# Altium schematic sheet CH32F203C8U6-R0.SchDoc
size 279 x 172 mm; SheetNumber: 0; SheetTotal: 0
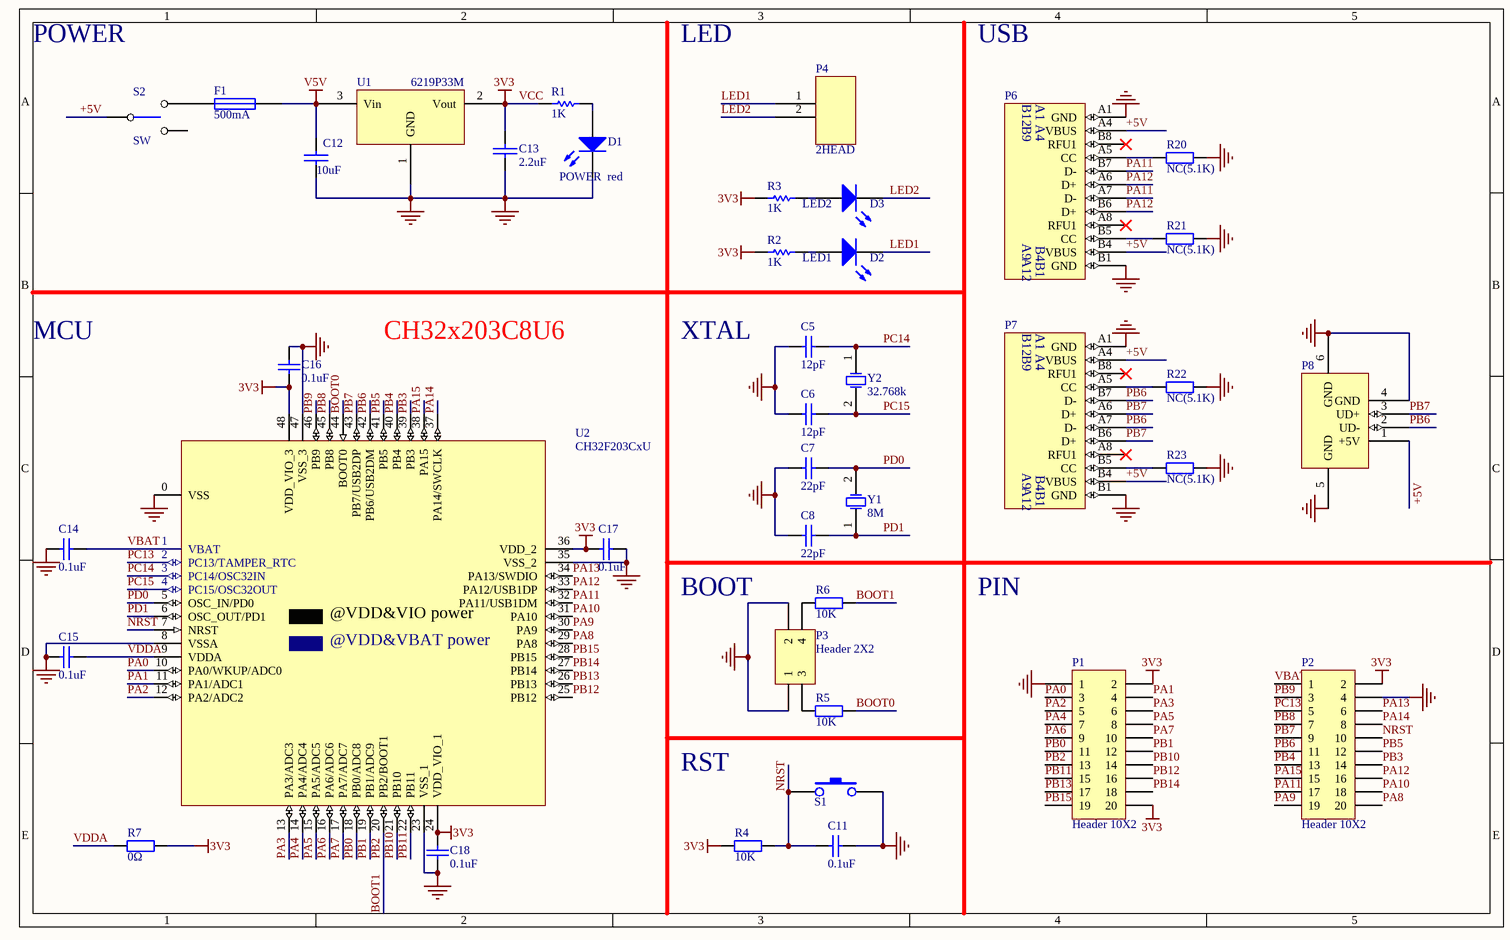
[diagram p0: CH32F203C8U6-R0.SchDoc]

## Parts
C5  12pF  [0603]
C6  12pF  [0603]
C7  22pF  [0603]
C8  22pF  [0603]
C11  0.1uF  [0603]
C12  10uF  [3216]
C13  2.2uF  [0603]
C14  0.1uF  [0603]
C15  0.1uF  [0603]
C16  0.1uF  [0603]
C17  0.1uF  [0603]
C18  0.1uF  [0603]
D1  POWER  red  [0603L]
D2  LED1  [0603L]
D3  LED2  [0603L]
F1  500mA  [0603]
P1  Header 10X2  [IDC20]
P2  Header 10X2  [IDC20]
P3  Header 2X2  [HDR2X2]
P4  2HEAD  [SIP2 - 40mil]
P6  TYPE-C  [TYPE-C-Receptacle-2.0]  (value not drawn)
P7  TYPE-C  [TYPE-C-Receptacle-2.0]  (value not drawn)
P8  USB_A  [USBA-L]  (value not drawn)
R1  1K  [0603]
R2  1K  [0603]
R3  1K  [0603]
R4  10K  [0603]
R5  10K  [0603]
R6  10K  [0603]
R7  0Ω  [0603]
R20  NC(5.1K)  [0603]
R21  NC(5.1K)  [0603]
R22  NC(5.1K)  [0603]
R23  NC(5.1K)  [0603]
S1  KEY  [贴片按键]  (value not drawn)
S2  SW  [KEY2]
U1  6219P33M  [SOT-23]
U2  CH32F203CxU  [QFN48_7X7]
Y1  8M  [XT62/28]
Y2  32.768k  [FC-135]

## Nets
GND: C5.2 C6.2 C7.1 C8.1 C11.1 C12.2 C13.2 C14.2 C15.2 C16.1 C17.1 C18.1 D1.2(K) P1.1 P2.4 P3.1 P3.2 P6.A1(GND) P6.B1(GND) P7.A1(GND) P7.B1(GND) P8.4(GND) P8.5(GND) P8.6(GND) R20.2 R21.2 R22.2 R23.2 S1.3 U1.1(GND) U2.0(VSS) U2.8(VSSA) U2.23(VSS_1) U2.35(VSS_2) U2.47(VSS_3)
V5V: C12.1 F1.2 U1.3(Vin)
VCC: C13.1 C16.2 C17.2 C18.2 P1.2 P1.20 P2.2 R1.2 R2.1 R3.1 R4.2 R7.1 U1.2(Vout) U2.24(VDD_VIO_1) U2.36(VDD_2) U2.48(VDD_VIO_3)  [also labelled 3V3]
+5V: P6.A4(VBUS) P6.B4(VBUS) P7.A4(VBUS) P7.B4(VBUS) P8.1(+5V) S2.1
BOOT0: R5.1 U2.44(BOOT0)
BOOT1: P1.13 R6.1 U2.20(PB2/BOOT1)  [also labelled PB2]
LED1: D2.2(K) P4.1
LED2: D3.2(K) P4.2
NRST: C11.2 P2.10 R4.1 S1.1 U2.7(NRST)
PA0: P1.3 U2.10(PA0/WKUP/ADC0)
PA1: P1.4 U2.11(PA1/ADC1)
PA2: P1.5 U2.12(PA2/ADC2)
PA3: P1.6 U2.13(PA3/ADC3)
PA4: P1.7 U2.14(PA4/ADC4)
PA5: P1.8 U2.15(PA5/ADC5)
PA6: P1.9 U2.16(PA6/ADC6)
PA7: P1.10 U2.17(PA7/ADC7)
PA8: P2.20 U2.29(PA8)
PA9: P2.19 U2.30(PA9)
PA10: P2.18 U2.31(PA10)
PA11: P2.17 P6.A7(D-) P6.B7(D-) U2.32(PA11/USB1DM)
PA12: P2.16 P6.A6(D+) P6.B6(D+) U2.33(PA12/USB1DP)
PA13: P2.6 U2.34(PA13/SWDIO)
PA14: P2.8 U2.37(PA14/SWCLK)
PA15: P2.15 U2.38(PA15)
PB0: P1.11 U2.18(PB0/ADC8)
PB1: P1.12 U2.19(PB1/ADC9)
PB3: P2.14 U2.39(PB3)
PB4: P2.13 U2.40(PB4)
PB5: P2.12 U2.41(PB5)
PB6: P2.11 P7.A7(D-) P7.B7(D-) P8.2(UD-) U2.42(PB6/USB2DM)
PB7: P2.9 P7.A6(D+) P7.B6(D+) P8.3(UD+) U2.43(PB7/USB2DP)
PB8: P2.7 U2.45(PB8)
PB9: P2.3 U2.46(PB9)
PB10: P1.14 U2.21(PB10)
PB11: P1.15 U2.22(PB11)
PB12: P1.16 U2.25(PB12)
PB13: P1.17 U2.26(PB13)
PB14: P1.18 U2.27(PB14)
PB15: P1.19 U2.28(PB15)
PC13: P2.5 U2.2(PC13/TAMPER_RTC)
PC14: C5.1 U2.3(PC14/OSC32IN) Y2.1(OSC1)
PC15: C6.1 U2.4(PC15/OSC32OUT) Y2.2(OSC2)
PD0: C7.2 U2.5(OSC_IN/PD0) Y1.2(OSC2)
PD1: C8.2 U2.6(OSC_OUT/PD1) Y1.1(OSC1)
VBAT: C14.1 P2.1 U2.1(VBAT)
VDDA: C15.1 R7.2 U2.9(VDDA)
NetD1_1: D1.1(A) R1.1
NetD2_1: D2.1(A) R2.2
NetD3_1: D3.1(A) R3.2
NetF1_1: F1.1 S2.3
NetP3_3: P3.3 R5.2
NetP3_4: P3.4 R6.2
NetP6_A5: P6.A5(CC) R20.1
NetP6_B5: P6.B5(CC) R21.1
NetP7_A5: P7.A5(CC) R22.1
NetP7_B5: P7.B5(CC) R23.1

Not connected (* = marked no-connect by the designer): P6 A8(RFU1)* B8(RFU1)*; P7 A8(RFU1)* B8(RFU1)*; S2 2

## Notes on the sheet
- POWER
- LED
- USB
- MCU
- CH32x203C8U6
- XTAL
- BOOT
- PIN
- RST
- Title
- Size:
- Date:
- A3
- Number:
- Time:
- Revision:
- Sheet
- of
- File:
- (in symbol CH32F203CxU) @VDD&VIO power; @VDD&VBAT power
- (in symbol TYPE-C1) B12; B9; A9; A12

## Library data of the parts
C5-C8 C11 C14-C18 = Cap: Capacitor; Published: 8-Jun-2000; LatestRevisionDate: 17-Jul-2002; LatestRevisionNote: Re-released for DXP Platform.; PackageReference: RAD-0.3; Publisher: Altium Limited
  C11: Value: 0.1uF
C12 C13 = CAP: Capacitor
D1-D3 = LED0: Typical INFRARED GaAs LED; Published: 8-Jun-2000; LatestRevisionDate: 08-Jul-2005; LatestRevisionNote: Mech Layer 1 removed.; PackageReference: LED-0; Publisher: Altium Limited
F1 = FUSE1: Fuse
P1 P2 = Header 10X2: Header, 10-Pin, Dual row; LatestRevisionDate: 17-Jul-2002; LatestRevisionNote: Re-released for DXP Platform.; Publisher: Altium Limited
P3 = Header 2X2: Header, 2-Pin, Dual row; LatestRevisionDate: 17-Jul-2002; LatestRevisionNote: Re-released for DXP Platform.; Publisher: Altium Limited
P6 P7 = TYPE-C1
P8 = USB: USB Port
R1-R3 = Res Semi: Semiconductor Resistor; Published: 8-Jun-2000; LatestRevisionDate: 17-Jul-2002; LatestRevisionNote: Re-released for DXP Platform.; PackageReference: AXIAL-0.5; Publisher: Altium Limited; Value: 1K
R4-R7 R20-R23 = Res2: Resistor
  R4-R6: Published: 8-Jun-2000; LatestRevisionDate: 17-Jul-2002; LatestRevisionNote: Re-released for DXP Platform.; PackageReference: AXIAL-0.4; Publisher: Altium Limited; Value: 10K
  R7: Published: 8-Jun-2000; LatestRevisionDate: 17-Jul-2002; LatestRevisionNote: Re-released for DXP Platform.; PackageReference: AXIAL-0.4; Publisher: Altium Limited
U2 = CH32F203CxU: ARM M3 LMD-MCU, 144MHz, 2*USB FS, CAN
Y1 Y2 = XTAL: Crystal Oscillator; Published: 8-Jun-2000; LatestRevisionDate: 17-Jul-2002; LatestRevisionNote: Re-released for DXP Platform.; PackageReference: R38; Publisher: Altium Limited